# Altium schematic sheet 0_Overview.SchDoc: Overview
size A3; DocumentNumber: 1; SheetNumber: 1; SheetTotal: 6; PageSetup: Record=PageOptions|CenterHorizontal=True|CenterVertical=True|PrintScale=1.01|XCorrection=1.00|YCorrection=1.00|PrintKind=0|BorderSize=5000000|LeftOffset=0|BottomOffset=0|Orientation=2|PaperLength=1000|PaperWidth=1000|Scale=100|PaperSource=7|PrintQuality=-4|MediaType=1|DitherType=10|PaperKind=A3|PrintScaleMode=1
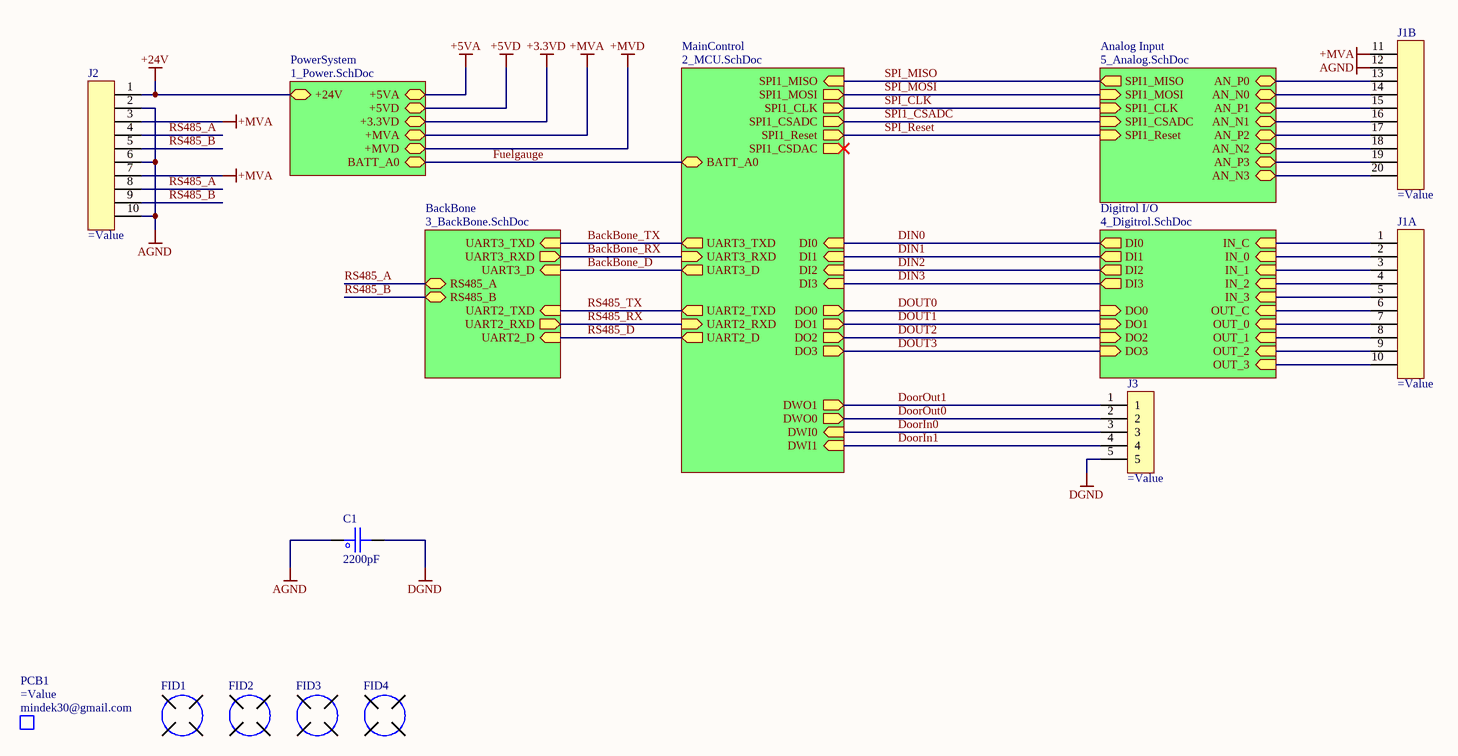
[diagram p0: 0_Overview.SchDoc]

## Parts
C1  2200pF  [C_1206]
FID1  FIDUCIAL  [FID]  (value not drawn)  (no BOM)
FID2  FIDUCIAL  [FID]  (value not drawn)  (no BOM)
FID3  FIDUCIAL  [FID]  (value not drawn)  (no BOM)
FID4  FIDUCIAL  [FID]  (value not drawn)  (no BOM)
J1  (no value)  [CON_20P_Terminal]  (parts A,B of 2)
J2  (no value)  [CON_10P_Terminal]
J3  (no value)  [MOLEX_532610571]
PCB1  Manufacturer: mindek30@gmail.com  (mechanical)

## Sub-sheets
Analog Input = 5_Analog.SchDoc: SPI1_MISO (out), SPI1_MOSI (in), SPI1_CLK (in), SPI1_CSADC (in), SPI1_Reset (in), AN_P0 (bidir), AN_P1 (bidir), AN_P2 (bidir), AN_P3 (bidir), AN_N0 (bidir), AN_N1 (bidir), AN_N2 (bidir), AN_N3 (bidir)
BackBone = 3_BackBone.SchDoc: UART3_D (in), UART2_TXD (in), UART2_RXD (out), UART2_D (in), UART3_TXD (in), UART3_RXD (out), RS485_A (bidir), RS485_B (bidir)
Digitrol I/O = 4_Digitrol.SchDoc: DI0 (out), DI1 (out), DI2 (out), DI3 (out), DO0 (in), DO1 (in), DO2 (in), DO3 (in), IN_0 (in), IN_1 (in), IN_2 (in), IN_3 (in), OUT_0 (in), OUT_1 (in), OUT_2 (in), OUT_3 (in), OUT_C (in), IN_C (in)
MainControl = 2_MCU.SchDoc: SPI1_MISO (in), SPI1_MOSI (out), SPI1_CLK (out), DI0 (in), DI1 (in), DI2 (in), DI3 (in), DO0 (out), DO1 (out), DO2 (out), DO3 (out), SPI1_Reset (out), UART3_TXD (out), UART3_RXD (in), UART3_D (out), UART2_TXD (out), UART2_RXD (in), UART2_D (out), BATT_A0 (bidir), SPI1_CSADC (out), SPI1_CSDAC (out), DWO0 (out), DWI1 (in), DWI0 (in), DWO1 (out)
PowerSystem = 1_Power.SchDoc: +5VA (bidir), +24V (bidir), +3.3VD (bidir), +MVA (bidir), +MVD (bidir), BATT_A0 (bidir), +5VD (bidir)

## Nets
+3.3VD: sheet PowerSystem/+3.3VD
+5VA: sheet PowerSystem/+5VA
+5VD: sheet PowerSystem/+5VD
+24V: J2.1 ; sheet PowerSystem/+24V
+MVA: J1.11 J2.3 J2.7 ; sheet PowerSystem/+MVA
+MVD: sheet PowerSystem/+MVD
AGND: C1.1 J1.12 J2.2 J2.6 J2.10
DGND: C1.2 J3.5
BackBone_D: sheet MainControl/UART3_D, sheet BackBone/UART3_D
BackBone_RX: sheet MainControl/UART3_RXD, sheet BackBone/UART3_RXD
BackBone_TX: sheet MainControl/UART3_TXD, sheet BackBone/UART3_TXD
DIN0: sheet MainControl/DI0, sheet Digitrol I/O/DI0
DIN1: sheet MainControl/DI1, sheet Digitrol I/O/DI1
DIN2: sheet MainControl/DI2, sheet Digitrol I/O/DI2
DIN3: sheet MainControl/DI3, sheet Digitrol I/O/DI3
DoorIn0: J3.3 ; sheet MainControl/DWI0
DoorIn1: J3.4 ; sheet MainControl/DWI1
DoorOut0: J3.2 ; sheet MainControl/DWO0
DoorOut1: J3.1 ; sheet MainControl/DWO1
DOUT0: sheet MainControl/DO0, sheet Digitrol I/O/DO0
DOUT1: sheet MainControl/DO1, sheet Digitrol I/O/DO1
DOUT2: sheet MainControl/DO2, sheet Digitrol I/O/DO2
DOUT3: sheet MainControl/DO3, sheet Digitrol I/O/DO3
Fuelgauge: sheet MainControl/BATT_A0, sheet PowerSystem/BATT_A0
RS485_A: J2.4 J2.8 ; sheet BackBone/RS485_A
RS485_B: J2.5 J2.9 ; sheet BackBone/RS485_B
RS485_D: sheet MainControl/UART2_D, sheet BackBone/UART2_D
RS485_RX: sheet MainControl/UART2_RXD, sheet BackBone/UART2_RXD
RS485_TX: sheet MainControl/UART2_TXD, sheet BackBone/UART2_TXD
SPI1_CSADC: sheet MainControl/SPI1_CSADC, sheet Analog Input/SPI1_CSADC
SPI_CLK: sheet MainControl/SPI1_CLK, sheet Analog Input/SPI1_CLK
SPI_MISO: sheet MainControl/SPI1_MISO, sheet Analog Input/SPI1_MISO
SPI_MOSI: sheet MainControl/SPI1_MOSI, sheet Analog Input/SPI1_MOSI
SPI_Reset: sheet MainControl/SPI1_Reset, sheet Analog Input/SPI1_Reset
NetJ1_1: J1.1 ; sheet Digitrol I/O/IN_C
NetJ1_2: J1.2 ; sheet Digitrol I/O/IN_0
NetJ1_3: J1.3 ; sheet Digitrol I/O/IN_1
NetJ1_4: J1.4 ; sheet Digitrol I/O/IN_2
NetJ1_5: J1.5 ; sheet Digitrol I/O/IN_3
NetJ1_6: J1.6 ; sheet Digitrol I/O/OUT_C
NetJ1_7: J1.7 ; sheet Digitrol I/O/OUT_0
NetJ1_8: J1.8 ; sheet Digitrol I/O/OUT_1
NetJ1_9: J1.9 ; sheet Digitrol I/O/OUT_2
NetJ1_10: J1.10 ; sheet Digitrol I/O/OUT_3
NetJ1_13: J1.13 ; sheet Analog Input/AN_P0
NetJ1_14: J1.14 ; sheet Analog Input/AN_N0
NetJ1_15: J1.15 ; sheet Analog Input/AN_P1
NetJ1_16: J1.16 ; sheet Analog Input/AN_N1
NetJ1_17: J1.17 ; sheet Analog Input/AN_P2
NetJ1_18: J1.18 ; sheet Analog Input/AN_N2
NetJ1_19: J1.19 ; sheet Analog Input/AN_P3
NetJ1_20: J1.20 ; sheet Analog Input/AN_N3

## Notes on the sheet
- Title :
- Revision :
- ผู้จัดทำ:
- Size:
- A3
- Time:
- ผู้เขียน:
- บริษัท ยูนิเวอร์แซล ยูทีลิตี้ส์ จำกัด (มหาชน) เลขที่ 1 อาคาร อีสท์วอเตอร์ ชั้น 18 ซอยวิภาวดีรังสิต 5 แขวงจอมพล เขตจตุจักร กรุงเทพฯ 10900
  Tel : +662-272-1688
  Fax :+662-2721690-1
- -
- Sheet:
- of
- ผู้อำนวยการ
- ผู้ตรวจสอบ:
- Number:
- กรรมการผู้จัดการ:
- File:

## Library data of the parts
C1 = C_Capacitor: CAP CER 2200PF 1KV X7R 1206; Manufacturer: AVX Corporation; PartNumber: 1206AC222KAT1A; PackageReference: 1206; PartID: 478-2953-1-ND; Value2: 1kV; Value: 2200pF; Value3: *
FID1-FID4 = FID_FIDUCIAL: Manufacturer: mindek30@gmail.com; Value2: Non SE; Value: Non SE; PartNumber: =PCB_PN+'_'+PCB_Rev; PartID: =PCB_Rev; PackageReference: Non SE; Value3: Non SE
J1 = CON_20P_Terminal: TERM BLOCK HDR 20POS 90DEG 3.5MM; PartNumber: KF2EDGK-20P; Value: KF2EDGK-20P; Value3: 1966172; PartID: KF2EDGK-20P; Manufacturer: *; PackageReference: *; Value2: *
J2 = CON_10P_Terminal: TERM BLOCK HDR 10POS 90DEG 3.5MM; PartNumber: KF2EDGK-10P; Value: KF2EDGK-10P; Value3: 1966172; PartID: KF2EDGK-10P; Manufacturer: *; PackageReference: *; Value2: *
J3 = CON_5P_532610571: CONN HEADER SMD R/A 5POS 1.25MM; PartNumber: 0532610571; Manufacturer: Molex; Value: 0532610571; Value2: AFC12-S05DCC-00; PartID: WM7623CT-ND; PackageReference: 5P; Value3: *
PCB1 = PCB_Bare: BARE PCB; PartNumber: =PCB_PN+'_'+PCB_Rev; PackageReference: Non SE; PartID: =PCB_Rev; Value2: =JobFile_Title; Value: =PartNumber; Value3: =PCBA_PN+'_'+PCBA_Rev